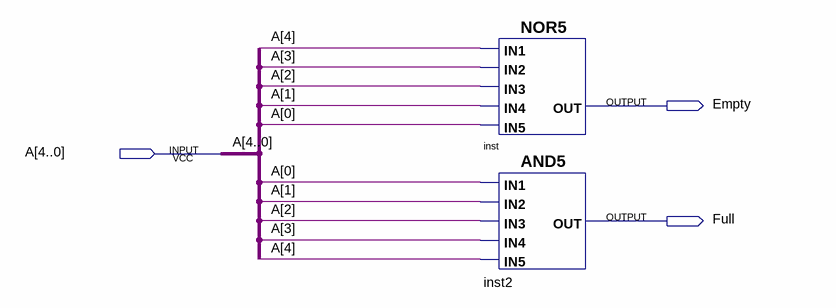
[diagram p0: schematic sheet]
// Quartus schematic OPLogic.bdf as structural Verilog: 2 symbols, 3 pins
module OPLogic (
  input  [4:0] A,
  output Empty,
  output Full
);

  nor inst (Empty, A[4], A[3], A[2], A[1], A[0]);
  and inst2 (Full, A[0], A[1], A[2], A[3], A[4]);
endmodule
